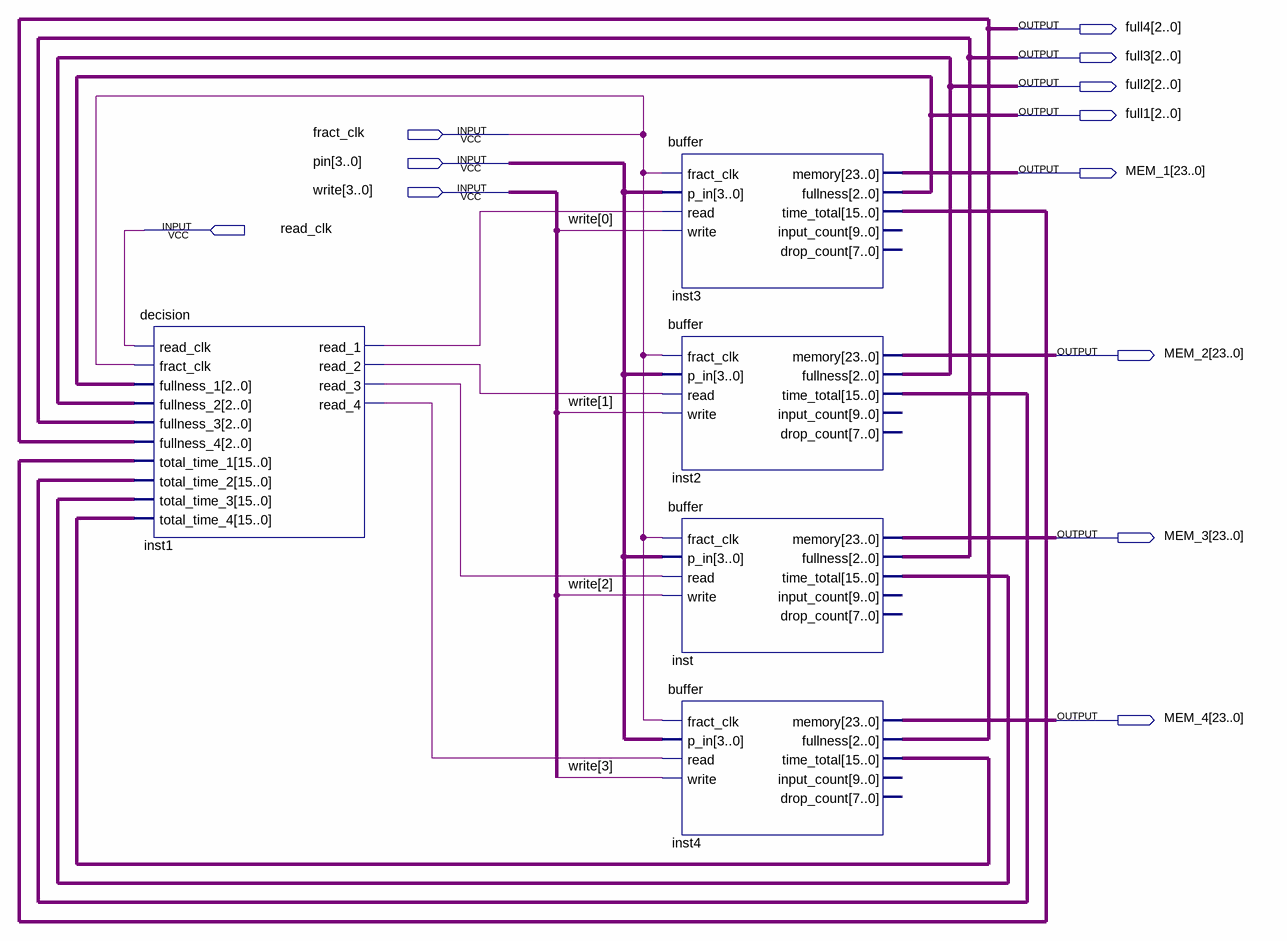
[diagram p0: schematic sheet]
// Quartus schematic decision_test.bdf as structural Verilog: 5 symbols, 12 pins
module decision_test (
  input  fract_clk,
  input  [3:0] pin,
  input  [3:0] write,
  input  read_clk,
  output [2:0] full4,
  output [2:0] full3,
  output [2:0] full2,
  output [2:0] full1,
  output [23:0] MEM_1,
  output [23:0] MEM_2,
  output [23:0] MEM_3,
  output [23:0] MEM_4
);

  wire inst1_read_1, inst1_read_2, inst1_read_3, inst1_read_4;
  wire [15:0] inst2_time_total, inst3_time_total, inst4_time_total, inst_time_total;

  decision inst1 (
    .read_clk(read_clk), .fract_clk(fract_clk), .fullness_1(full1), .fullness_2(full2), .fullness_3(full3),
    .fullness_4(full4), .total_time_1(inst3_time_total), .total_time_2(inst2_time_total),
    .total_time_3(inst_time_total), .total_time_4(inst4_time_total), .read_1(inst1_read_1),
    .read_2(inst1_read_2), .read_3(inst1_read_3), .read_4(inst1_read_4));
  buffer inst3 (
    .fract_clk(fract_clk), .p_in(pin), .read(inst1_read_1), .write(write[0]), .memory(MEM_1),
    .fullness(full1), .time_total(inst3_time_total));  // open: input_count, drop_count
  buffer inst2 (
    .fract_clk(fract_clk), .p_in(pin), .read(inst1_read_2), .write(write[1]), .memory(MEM_2),
    .fullness(full2), .time_total(inst2_time_total));  // open: input_count, drop_count
  buffer inst (
    .fract_clk(fract_clk), .p_in(pin), .read(inst1_read_3), .write(write[2]), .memory(MEM_3),
    .fullness(full3), .time_total(inst_time_total));  // open: input_count, drop_count
  buffer inst4 (
    .fract_clk(fract_clk), .p_in(pin), .read(inst1_read_4), .write(write[3]), .memory(MEM_4),
    .fullness(full4), .time_total(inst4_time_total));  // open: input_count, drop_count
endmodule
